# Altium project ESP32-C3-RF-V1.0.PrjPcb (part 3 of 4)
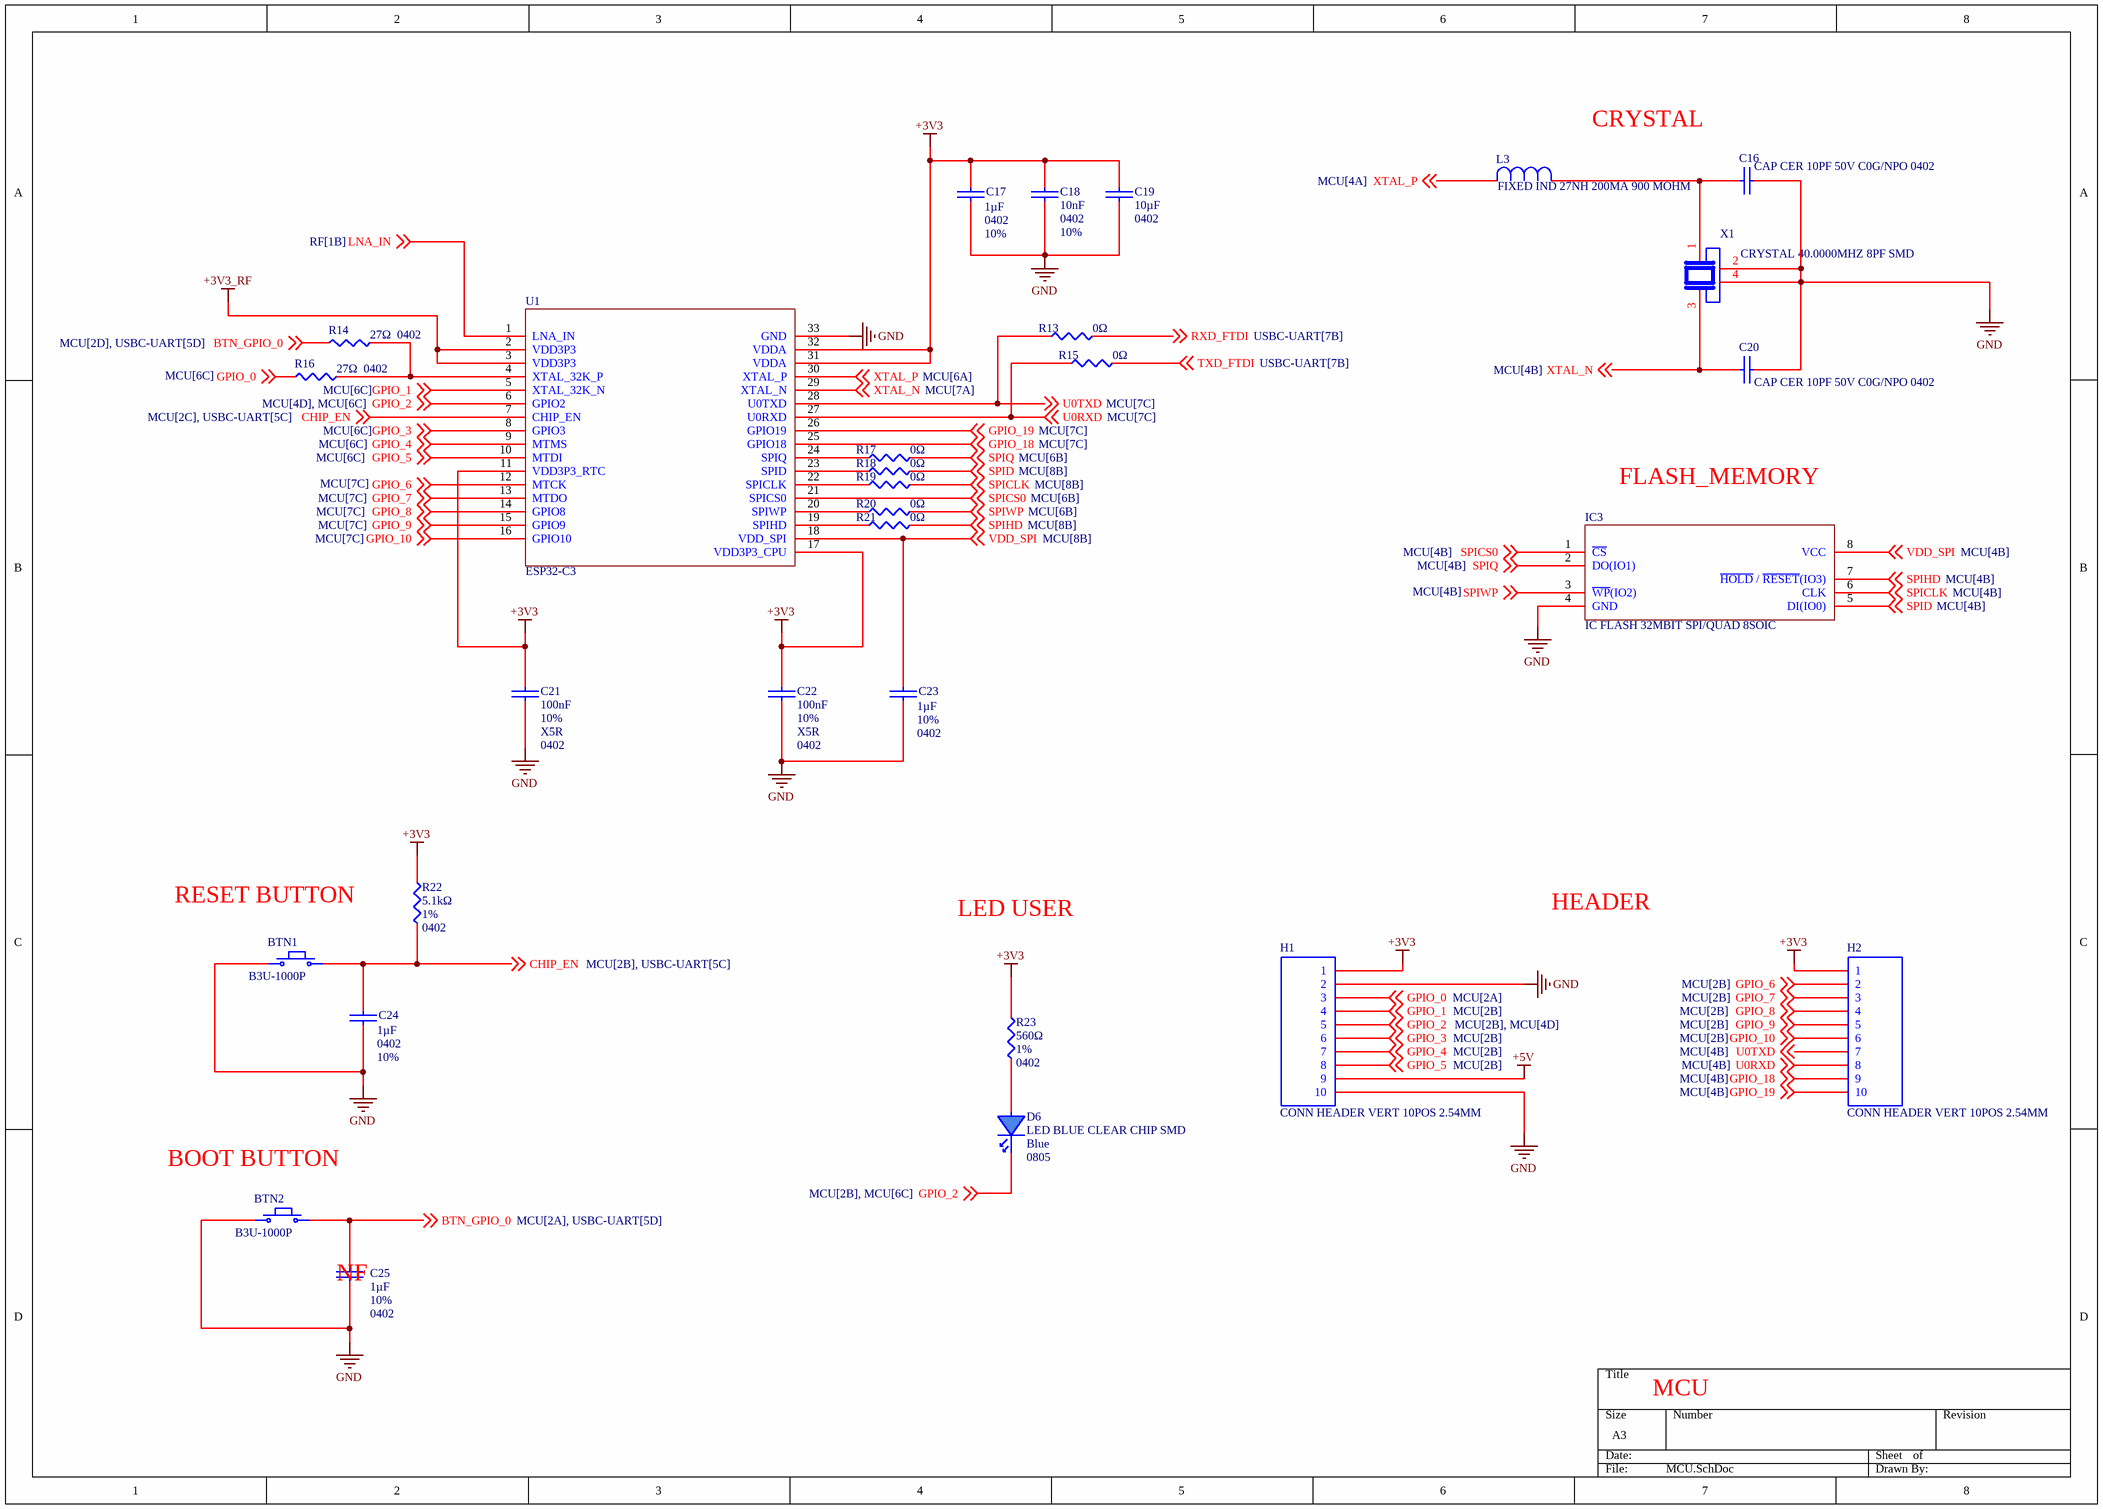
[diagram p6: MCU.SchDoc]

## Sheet MCU.SchDoc (continued)

### Parts
BTN1  SWITCH TACTILE SPST-NO 0.05A 12V  [SW_B3U-1000P]  (value not drawn)
BTN2  SWITCH TACTILE SPST-NO 0.05A 12V  [SW_B3U-1000P]  (value not drawn)
C16  CAP CER 10PF 50V C0G/NPO 0402  [C0402]
C17  value 1µF  Case/Package: 0402  Tolerance: 10%  [C0402]  (hidden comment: CAP CER 1UF 10V X5R 0402)
C18  value 10nF  Case/Package: 0402  Tolerance: 10%  [C0402]  (hidden comment: CAP CER 10000PF 16V X7R 0402)
C19  value 10µF  Case/Package: 0402  [C0402]  (hidden comment: CAP CER 10UF 10V X5R 0402)
C20  CAP CER 10PF 50V C0G/NPO 0402  [C0402]
C21  value 100nF  Tolerance: 10%  Dielectric: X5R  Case/Package: 0402  [C0402]  (hidden comment: CAP CER 100nF 50V X5R 0402)
C22  value 100nF  Tolerance: 10%  Dielectric: X5R  Case/Package: 0402  [C0402]  (hidden comment: CAP CER 100nF 50V X5R 0402)
C23  value 1µF  Case/Package: 0402  Tolerance: 10%  [C0402]  (hidden comment: CAP CER 1UF 10V X5R 0402)
C24  value 1µF  Case/Package: 0402  Tolerance: 10%  [C0402]  (hidden comment: CAP CER 1UF 10V X5R 0402)
C25  value 1µF  Case/Package: 0402  Tolerance: 10%  [C0402]  (hidden comment: CAP CER 1UF 10V X5R 0402)
D6  LED BLUE CLEAR CHIP SMD  Color: Blue  Case/Package: 0805  [LED_0805_BLUE]
H1  CONN HEADER VERT 10POS 2.54MM  [Header 1*10 2.54mm]
H2  CONN HEADER VERT 10POS 2.54MM  [Header 1*10 2.54mm]
IC3  IC FLASH 32MBIT SPI/QUAD 8SOIC  [SOIC-8_5P28X5P28_WIN-L]
L3  FIXED IND 27NH 200MA 900 MOHM  [IND_L-0402_JOT-L]
R13  value 0Ω  [R0402]  (hidden comment: RES 0 OHM JUMPER 1/16W 0402)
R14  value 27Ω  Case/Package: 0402  [R0402]  (hidden comment: RES SMD 27 OHM 1% 1/16W 0402)
R15  value 0Ω  [R0402]  (hidden comment: RES 0 OHM JUMPER 1/16W 0402)
R16  value 27Ω  Case/Package: 0402  [R0402]  (hidden comment: RES SMD 27 OHM 1% 1/16W 0402)
R17  value 0Ω  [R0402]  (hidden comment: RES 0 OHM JUMPER 1/16W 0402)
R18  value 0Ω  [R0402]  (hidden comment: RES 0 OHM JUMPER 1/16W 0402)
R19  value 0Ω  [R0402]  (hidden comment: RES 0 OHM JUMPER 1/16W 0402)
R20  value 0Ω  [R0402]  (hidden comment: RES 0 OHM JUMPER 1/16W 0402)
R21  value 0Ω  [R0402]  (hidden comment: RES 0 OHM JUMPER 1/16W 0402)
R22  value 5.1kΩ  Tolerance: 1%  Case/Package: 0402  [R0402]  (hidden comment: RES 5.1kΩ ±1% 62.5mW 0402)
R23  value 560Ω  Tolerance: 1%  Case/Package: 0402  [R0402]  (hidden comment: RES 560 OHM 1% 1/16W 0402)
U1  ESP32-C3  [ESP-C3]
X1  CRYSTAL 40.0000MHZ 8PF SMD  [OSC_XRCGB40M000F1S1BR0]

### Nets
+3V3: C17.1 C18.2 C19.2 C21.2 C22.2 H1.1 H2.1 R22.2 R23.2 U1.11(VDD3P3_RTC) U1.17(VDD3P3_CPU) U1.31(VDDA) U1.32(VDDA)
+3V3_RF: U1.2(VDD3P3) U1.3(VDD3P3)
+5V: H1.9
GND: BTN1.1 BTN2.1 C16.1 C17.2 C18.1 C19.1 C20.1 C21.1 C22.1 C23.1 C24.1 C25.1 H1.2 H1.10 IC3.4(GND) U1.33(GND) X1.2 X1.4
BTN_GPIO_0: BTN2.2 C25.2 R14.1 ; off-sheet BTN_GPIO_0
CHIP_EN: BTN1.2 C24.2 R22.1 U1.7(CHIP_EN) ; off-sheet CHIP_EN
GPIO_0: H1.3 R16.1 ; off-sheet GPIO_0
GPIO_1: H1.4 U1.5(XTAL_32K_N) ; off-sheet GPIO_1
GPIO_2: D6.1 H1.5 U1.6(GPIO2) ; off-sheet GPIO_2
GPIO_3: H1.6 U1.8(GPIO3) ; off-sheet GPIO_3
GPIO_4: H1.7 U1.9(MTMS) ; off-sheet GPIO_4
GPIO_5: H1.8 U1.10(MTDI) ; off-sheet GPIO_5
GPIO_6: H2.2 U1.12(MTCK) ; off-sheet GPIO_6
GPIO_7: H2.3 U1.13(MTDO) ; off-sheet GPIO_7
GPIO_8: H2.4 U1.14(GPIO8) ; off-sheet GPIO_8
GPIO_9: H2.5 U1.15(GPIO9) ; off-sheet GPIO_9
GPIO_10: H2.6 U1.16(GPIO10) ; off-sheet GPIO_10
GPIO_18: H2.9 U1.25(GPIO18) ; off-sheet GPIO_18
GPIO_19: H2.10 U1.26(GPIO19) ; off-sheet GPIO_19
LNA_IN: U1.1(LNA_IN) ; off-sheet LNA_IN
RXD_FTDI: R13.2 ; off-sheet RXD_FTDI
SPICLK: IC3.6(CLK) R19.2 ; off-sheet SPICLK
SPICS0: IC3.1(~{CS}) U1.21(SPICS0) ; off-sheet SPICS0
SPID: IC3.5(DI(IO0)) R18.2 ; off-sheet SPID
SPIHD: IC3.7(~{HOLD}_/_~{RESET}(IO3)) R21.2 ; off-sheet SPIHD
SPIQ: IC3.2(DO(IO1)) R17.2 ; off-sheet SPIQ
SPIWP: IC3.3(~{WP}(IO2)) R20.2 ; off-sheet SPIWP
TXD_FTDI: R15.2 ; off-sheet TXD_FTDI
U0RXD: H2.8 R15.1 U1.27(U0RXD) ; off-sheet U0RXD
U0TXD: H2.7 R13.1 U1.28(U0TXD) ; off-sheet U0TXD
VDD_SPI: C23.2 IC3.8(VCC) U1.18(VDD_SPI) ; off-sheet VDD_SPI
XTAL_N: C20.2 U1.29(XTAL_N) X1.3 ; off-sheet XTAL_N
XTAL_P: L3.2 U1.30(XTAL_P) ; off-sheet XTAL_P
NetC16_2: C16.2 L3.1 X1.1
NetD6_2: D6.2 R23.1
NetR14_2: R14.2 R16.2 U1.4(XTAL_32K_P)
NetR17_1: R17.1 U1.24(SPIQ)
NetR18_1: R18.1 U1.23(SPID)
NetR19_1: R19.1 U1.22(SPICLK)
NetR20_1: R20.1 U1.20(SPIWP)
NetR21_1: R21.1 U1.19(SPIHD)

### Notes on the sheet
- CRYSTAL
- FLASH_MEMORY
- RESET BUTTON
- LED USER
- HEADER
- (near BTN2) BOOT BUTTON
- (near C25) NF
- MCU
### Library data of the parts
BTN1 BTN2 = B3U-1000P: Switch Tactile N.O. SPST Round Button Solder Tab 12VDC 200000Cycles 1.5N SMD Emboss T/R; Manufacturer: Omron; Manufacturer Package Identifier: B3U-1000P(M); Actuator Length: 400µm; Contact Current Rating: 50mA; Contact Resistance: 100mΩ; Electrical Life: 200kcycles; Illumination Type: Illuminated, Non-Illuminated; Number of Positions: 1; Operating Force: 1.99N; Ratings: Dust Proof, IP40; Sealable: DUST PROOF; Switch Function: Off-Mom; Switch Travel: 150µm; Supplier: DigiKey; Supplier Part Number: SW1020CT-ND; Manufacturer Part Number: B3U-1000P; RoHS: Compliant; Category: Tactile Switches; Stock: 127276; Pricing: 1=1,17, 10=0,997, 25=0,9268, 100=0,8261, 250=0,76544, 500=0,72342, 1000=0,68504 (USD); Ambient Temperature Range High: 70°C; Color: Silver; Contact Material: Silver; Contact Plating: Silver; Current Rating: 50mA; Depth: 2.5mm; Height: 1.2mm; Insulation Resistance: 100MΩ; Lead Free: Lead Free; Length: 3mm; Life (Cycles): 200kcycles; Lifecycle Status: Production; Max Current Rating: 50mA; Max Operating Temperature: 70°C; Max Voltage Rating (DC): 12V; Mechanical Life: 200kcycles; Min Operating Temperature: -25°C; Mounting Technology: Surface Mount; Pins: 2; Packaging: Tape and Reel; REACH SVHC: Yes; Termination: SMD/SMT; Throw Configuration: SPST; Voltage Rating (DC): 12V; Weight: 21.99923mg; Width: 2.5mm; ComponentLink1URL: https://datasheet.octopart.com:443/B3U-1000P-Omron-datasheet-62106914.pdf?src-supplier=IHS; ComponentLink1Description: https://datasheet.octopart.com:443/B3U-1000P-Omron-datasheet-62106914.pdf?src-supplier=IHS; ComponentLink2URL: https://datasheet.octopart.com:443/B3U-1000P-Omron-datasheet-10910421.pdf?src-supplier=RS+(Formerly+Allied+Electronics); ComponentLink2Description: https://datasheet.octopart.com:443/B3U-1000P-Omron-datasheet-10910421.pdf?src-supplier=RS+(Formerly+Allied+Electronics); ComponentLink3URL: https://datasheet.octopart.com:443/B3U-1000P-Omron-datasheet-5458533.pdf?src-supplier=Upverter; ComponentLink3Description: https://datasheet.octopart.com:443/B3U-1000P-Omron-datasheet-5458533.pdf?src-supplier=Upverter; ComponentLink4URL: https://datasheet.octopart.com:443/B3U-1000P-Omron-datasheet-11968313.pdf?src-supplier=SOS+electronic; ComponentLink4Description: https://datasheet.octopart.com:443/B3U-1000P-Omron-datasheet-11968313.pdf?src-supplier=SOS+electronic; ComponentLink5URL: https://datasheet.octopart.com:443/B3U-1000P-Omron-datasheet-110759174.pdf?src-supplier=Newark; ComponentLink5Description: https://datasheet.octopart.com:443/B3U-1000P-Omron-datasheet-110759174.pdf?src-supplier=Newark; ComponentLink6URL: https://datasheet.octopart.com:443/B3U-1000P-Omron-datasheet-506776.pdf?src-supplier=Newark; ComponentLink6Description: https://datasheet.octopart.com:443/B3U-1000P-Omron-datasheet-506776.pdf?src-supplier=Newark; ComponentLink7URL: https://datasheet.octopart.com:443/B3U-1000P-Omron-datasheet-17589256.pdf?src-supplier=TME; ComponentLink7Description: https://datasheet.octopart.com:443/B3U-1000P-Omron-datasheet-17589256.pdf?src-supplier=TME; LCSC Part: C231329
C16 C20 = CC0402FPNPO9BN100: Ceramic Capacitor, Multilayer, Ceramic, 50V, 1% +Tol, 1% -Tol, C0G, 30ppm/Cel TC, 0.00001uF, Surface Mount, 0402; Manufacturer: Yageo Group; Supplier: DigiKey; Supplier Part Number: 13-CC0402FPNPO9BN100CT-ND; Manufacturer Part Number: CC0402FPNPO9BN100; RoHS: Compliant; Category: Ceramic Capacitors; Stock: 180901; Pricing: 1=0,1, 10=0,05, 50=0,034, 100=0,0292, 500=0,02122, 1000=0,01878, 2500=0,01622, 5000=0,01467 (USD); China RoHS: Compliant; Country of Origin: Mainland China, Taiwan; Dielectric Material: Ceramic; Export Control Classification Number (ECCN) Code: EAR99; Height: 500µm; Harmonized Tariff Schedule (HTS) Code: 8532.24.00.20; Introduction Date: 2009-04-16; Length: 1mm; Lifecycle Status: Production; Max Operating Temperature: 125°C; Min Operating Temperature: -55°C; Mounting Technology: Surface Mount; Number of Terminals: 2; REACH SVHC: Yes; Voltage Rating (DC): 50V; Width: 500µm; ComponentLink1URL: https://datasheet.octopart.com:443/CC0402FPNPO9BN100-Yageo-datasheet-182140217.pdf?src-supplier=IHS; ComponentLink1Description: https://datasheet.octopart.com:443/CC0402FPNPO9BN100-Yageo-datasheet-182140217.pdf?src-supplier=IHS; ComponentLink2URL: http://sigma.octopart.com:80/conflict_mineral_statement/Yageo-company-3.pdf?src-supplier=Compliance+Statements; ComponentLink2Description: http://sigma.octopart.com:80/conflict_mineral_statement/Yageo-company-3.pdf?src-supplier=Compliance+Statements; ComponentLink3URL: http://sigma.octopart.com:80/rohs_statement/Yageo-company-2.pdf?src-supplier=Compliance+Statements; ComponentLink3Description: http://sigma.octopart.com:80/rohs_statement/Yageo-company-2.pdf?src-supplier=Compliance+Statements; LCSC Part: C3896396; Value: 10pF
C17 C23-C25 = CC0402KRX5R6BB105: Multilayer Ceramic Capacitors MLCC – SMD/SMT; YAGEO; CC0402KRX5R6BB105; 1 µF; 0402; 10 V; 10 V; Manufacturer: Yageo Group; Dissipation Factor: 15%; Temperature Coefficient: 30ppm/°C; Supplier: DigiKey; Supplier Part Number: 311-1439-1-ND; Manufacturer Part Number: CC0402KRX5R6BB105; RoHS: Compliant; Category: Ceramic Capacitors; Stock: 575623; Pricing: 1=0,11, 10=0,06, 50=0,0412, 100=0,0356, 500=0,02612, 1000=0,02323, 2500=0,02018, 5000=0,01835 (USD); Case Code (Imperial): 0402; Case Code (Metric): 1005; China RoHS: Compliant; Composition: Ceramic; Country of Origin: Mainland China, Taiwan; Depth: 500µm; Dielectric: X5R; Dielectric Material: Ceramic; Export Control Classification Number (ECCN) Code: EAR99; Halogen Free: Halogen Free; Height: 500µm; Harmonized Tariff Schedule (HTS) Code: 8532.24.00.20; Introduction Date: 2009-04-16; Lead Free: Lead Free; Length: 1mm; Lifecycle Status: Production; Material: Ceramic; Max Operating Temperature: 85°C; Min Operating Temperature: -55°C; Mounting Technology: Surface Mount; Pins: 2; Number of Terminals: 2; Packaging: Cut Tape (CT); Radiation Hardening: No; REACH SVHC: Yes; Schedule B: 8532240020, 8532240020|8532240020|8532240020|8532240020|8532240020|8532240020|8532240020|8532240020|8532240020|8532240020|8532240020|8532240020|8532240020|8532240020|8532240020|8532240020|8532240020|8532240020|8532240020|8532240020|8532240020|8532240020|8532240020|85; Termination: SMD/SMT; Thickness: 558.8µm; Voltage Rating: 10V; Voltage Rating (DC): 10V; Width: 500µm; ComponentLink1URL: https://datasheet.octopart.com:443/CC0402KRX5R6BB105-Yageo-datasheet-170350636.pdf?src-supplier=IHS; ComponentLink1Description: https://datasheet.octopart.com:443/CC0402KRX5R6BB105-Yageo-datasheet-170350636.pdf?src-supplier=IHS; ComponentLink2URL: https://datasheet.octopart.com:443/CC0402KRX5R6BB105-Yageo-datasheet-10911834.pdf?src-supplier=Farnell; ComponentLink2Description: https://datasheet.octopart.com:443/CC0402KRX5R6BB105-Yageo-datasheet-10911834.pdf?src-supplier=Farnell; ComponentLink3URL: https://datasheet.octopart.com:443/CC0402KRX5R6BB105-Yageo-datasheet-78855684.pdf?src-supplier=Upverter; ComponentLink3Description: https://datasheet.octopart.com:443/CC0402KRX5R6BB105-Yageo-datasheet-78855684.pdf?src-supplier=Upverter; ComponentLink4URL: https://datasheet.octopart.com:443/CC0402KRX5R6BB105-Yageo-datasheet-8324442.pdf?src-supplier=element14+APAC; ComponentLink4Description: https://datasheet.octopart.com:443/CC0402KRX5R6BB105-Yageo-datasheet-8324442.pdf?src-supplier=element14+APAC; ComponentLink5URL: https://datasheet.octopart.com:443/CC0402KRX5R6BB105-Yageo-datasheet-181967186.pdf?src-supplier=Newark; ComponentLink5Description: https://datasheet.octopart.com:443/CC0402KRX5R6BB105-Yageo-datasheet-181967186.pdf?src-supplier=Newark; ComponentLink6URL: https://datasheet.octopart.com:443/CC0402KRX5R6BB105-Yageo-datasheet-181967185.pdf?src-supplier=Newark; ComponentLink6Description: https://datasheet.octopart.com:443/CC0402KRX5R6BB105-Yageo-datasheet-181967185.pdf?src-supplier=Newark; ComponentLink7URL: https://datasheet.octopart.com:443/CC0402KRX5R6BB105-Yageo-datasheet-519481.pdf?src-supplier=Newark; ComponentLink7Description: https://datasheet.octopart.com:443/CC0402KRX5R6BB105-Yageo-datasheet-519481.pdf?src-supplier=Newark; ComponentLink8URL: https://datasheet.octopart.com:443/CC0402KRX5R6BB105-Yageo-datasheet-62067349.pdf?src-supplier=Newark; ComponentLink8Description: https://datasheet.octopart.com:443/CC0402KRX5R6BB105-Yageo-datasheet-62067349.pdf?src-supplier=Newark; ComponentLink9URL: https://datasheet.octopart.com:443/CC0402KRX5R6BB105-Yageo-datasheet-169689537.pdf?src-supplier=Newark; ComponentLink9Description: https://datasheet.octopart.com:443/CC0402KRX5R6BB105-Yageo-datasheet-169689537.pdf?src-supplier=Newark; ComponentLink10URL: https://datasheet.octopart.com:443/CC0402KRX5R6BB105-Yageo-datasheet-158238148.pdf?src-supplier=JRH+Electronics; ComponentLink10Description: https://datasheet.octopart.com:443/CC0402KRX5R6BB105-Yageo-datasheet-158238148.pdf?src-supplier=JRH+Electronics; ComponentLink11URL: https://datasheet.octopart.com/CC0402KRX5R6BB105-Yageo-datasheet-86397281.pdf; ComponentLink11Description: https://datasheet.octopart.com/CC0402KRX5R6BB105-Yageo-datasheet-86397281.pdf; ComponentLink12URL: https://datasheet.octopart.com:443/CC0402KRX5R6BB105-Yageo-datasheet-149070021.pdf?src-supplier=TME; ComponentLink12Description: https://datasheet.octopart.com:443/CC0402KRX5R6BB105-Yageo-datasheet-149070021.pdf?src-supplier=TME; ComponentLink13URL: https://datasheet.octopart.com:443/CC0402KRX5R6BB105-Yageo-Group-datasheet-145016144.pdf?src-supplier=ODG+(Origin+Data+Global); ComponentLink13Description: https://datasheet.octopart.com:443/CC0402KRX5R6BB105-Yageo-Group-datasheet-145016144.pdf?src-supplier=ODG+(Origin+Data+Global); ComponentLink14URL: https://datasheet.octopart.com:443/CC0402KRX5R6BB105-Yageo-datasheet-137875056.pdf?src-supplier=Future+Electronics; ComponentLink14Description: https://datasheet.octopart.com:443/CC0402KRX5R6BB105-Yageo-datasheet-137875056.pdf?src-supplier=Future+Electronics; ComponentLink15URL: https://datasheet.octopart.com:443/CC0402KRX5R6BB105-Yageo-datasheet-137700085.pdf?src-supplier=Future+Electronics; ComponentLink15Description: https://datasheet.octopart.com:443/CC0402KRX5R6BB105-Yageo-datasheet-137700085.pdf?src-supplier=Future+Electronics; ComponentLink16URL: https://datasheet.octopart.com:443/CC0402KRX5R6BB105-Yageo-datasheet-59875459.pdf?src-supplier=Future+Electronics; ComponentLink16Description: https://datasheet.octopart.com:443/CC0402KRX5R6BB105-Yageo-datasheet-59875459.pdf?src-supplier=Future+Electronics; ComponentLink17URL: https://datasheet.octopart.com:443/CC0402KRX5R6BB105-Yageo-datasheet-24578986.pdf?src-supplier=Future+Electronics; ComponentLink17Description: https://datasheet.octopart.com:443/CC0402KRX5R6BB105-Yageo-datasheet-24578986.pdf?src-supplier=Future+Electronics; ComponentLink18URL: https://datasheet.octopart.com:443/CC0402KRX5R6BB105-Yageo-datasheet-8701639.pdf?src-supplier=element14; ComponentLink18Description: https://datasheet.octopart.com:443/CC0402KRX5R6BB105-Yageo-datasheet-8701639.pdf?src-supplier=element14; ComponentLink19URL: https://datasheet.octopart.com:443/CC0402KRX5R6BB105-Yageo-datasheet-68071816.pdf?src-supplier=Megastar; ComponentLink19Description: https://datasheet.octopart.com:443/CC0402KRX5R6BB105-Yageo-datasheet-68071816.pdf?src-supplier=Megastar; ComponentLink20URL: http://sigma.octopart.com:80/conflict_mineral_statement/Yageo-company-3.pdf?src-supplier=Compliance+Statements; ComponentLink20Description: http://sigma.octopart.com:80/conflict_mineral_statement/Yageo-company-3.pdf?src-supplier=Compliance+Statements; ComponentLink21URL: http://sigma.octopart.com:80/rohs_statement/Yageo-company-2.pdf?src-supplier=Compliance+Statements; ComponentLink21Description: http://sigma.octopart.com:80/rohs_statement/Yageo-company-2.pdf?src-supplier=Compliance+Statements; LCSC Part: C106254
C18 = CC0402KRX7R7BB103: Multilayer Ceramic Capacitors MLCC - SMD/SMT 16V 0.01uF X7R 0402 10%; Manufacturer: Yageo Group; Dissipation Factor: 3.5%; Temperature Coefficient: 30ppm/°C; Supplier: DigiKey; Supplier Part Number: 311-1042-1-ND; Manufacturer Part Number: CC0402KRX7R7BB103; RoHS: Compliant; Category: Ceramic Capacitors; Stock: 5468572; Pricing: 1=0,1, 10=0,019, 50=0,0124, 100=0,0105, 500=0,00728, 1000=0,0063, 2500=0,00527, 5000=0,00465 (USD); Case Code (Imperial): 0402; Case Code (Metric): 1005; China RoHS: Compliant; Country of Origin: Mainland China, Taiwan; Depth: 500µm; Dielectric: X7R; Dielectric Material: Ceramic; Export Control Classification Number (ECCN) Code: EAR99; Halogen Free: Halogen Free; Height: 500µm; Harmonized Tariff Schedule (HTS) Code: 8532.24.00.20; Introduction Date: 2003-01-27; Lead Free: Lead Free; Length: 1mm; Lifecycle Status: Production; Material: Ceramic; Max Operating Temperature: 125°C; Min Operating Temperature: -55°C; Mounting Technology: Surface Mount; Pins: 2; Number of Terminals: 2; Radiation Hardening: No; REACH SVHC: Yes; Schedule B: 8532240020, 8532240020|8532240020, 8532240020|8532240020|8532240020, 8532240020|8532240020|8532240020|8532240020; Termination: SMD/SMT; Thickness: 558.8µm; Voltage: 16V; Voltage Rating: 16V; Voltage Rating (AC): 16V; Voltage Rating (DC): 16V; Width: 500µm; ComponentLink1URL: https://datasheet.octopart.com:443/CC0402KRX7R7BB103-Yageo-datasheet-177165144.pdf?src-supplier=IHS; ComponentLink1Description: https://datasheet.octopart.com:443/CC0402KRX7R7BB103-Yageo-datasheet-177165144.pdf?src-supplier=IHS; ComponentLink2URL: https://datasheet.octopart.com:443/CC0402KRX7R7BB103-Yageo-datasheet-78855684.pdf?src-supplier=Upverter; ComponentLink2Description: https://datasheet.octopart.com:443/CC0402KRX7R7BB103-Yageo-datasheet-78855684.pdf?src-supplier=Upverter; ComponentLink3URL: https://datasheet.octopart.com/CC0402KRX7R7BB103-Yageo-datasheet-10883670.pdf; ComponentLink3Description: https://datasheet.octopart.com/CC0402KRX7R7BB103-Yageo-datasheet-10883670.pdf; ComponentLink4URL: https://datasheet.octopart.com:443/CC0402KRX7R7BB103-Yageo-datasheet-147453679.pdf?src-supplier=Newark; ComponentLink4Description: https://datasheet.octopart.com:443/CC0402KRX7R7BB103-Yageo-datasheet-147453679.pdf?src-supplier=Newark; ComponentLink5URL: https://datasheet.octopart.com:443/CC0402KRX7R7BB103-Phycomp-datasheet-499490.pdf?src-supplier=Newark; ComponentLink5Description: https://datasheet.octopart.com:443/CC0402KRX7R7BB103-Phycomp-datasheet-499490.pdf?src-supplier=Newark; ComponentLink6URL: https://datasheet.octopart.com:443/CC0402KRX7R7BB103-Yageo-datasheet-15895757.pdf?src-supplier=Newark; ComponentLink6Description: https://datasheet.octopart.com:443/CC0402KRX7R7BB103-Yageo-datasheet-15895757.pdf?src-supplier=Newark; ComponentLink7URL: https://datasheet.octopart.com:443/CC0402KRX7R7BB103-Yageo-datasheet-182050773.pdf?src-supplier=Newark; ComponentLink7Description: https://datasheet.octopart.com:443/CC0402KRX7R7BB103-Yageo-datasheet-182050773.pdf?src-supplier=Newark; ComponentLink8URL: https://datasheet.octopart.com:443/CC0402KRX7R7BB103-Yageo-datasheet-182050772.pdf?src-supplier=Newark; ComponentLink8Description: https://datasheet.octopart.com:443/CC0402KRX7R7BB103-Yageo-datasheet-182050772.pdf?src-supplier=Newark; ComponentLink9URL: https://datasheet.octopart.com:443/CC0402KRX7R7BB103-Yageo-datasheet-62336348.pdf?src-supplier=Farnell; ComponentLink9Description: https://datasheet.octopart.com:443/CC0402KRX7R7BB103-Yageo-datasheet-62336348.pdf?src-supplier=Farnell; ComponentLink10URL: https://datasheet.octopart.com:443/CC0402KRX7R7BB103-Yageo-datasheet-151948686.pdf?src-supplier=Farnell; ComponentLink10Description: https://datasheet.octopart.com:443/CC0402KRX7R7BB103-Yageo-datasheet-151948686.pdf?src-supplier=Farnell; ComponentLink11URL: https://datasheet.octopart.com:443/CC0402KRX7R7BB103-Phycomp-datasheet-500777.pdf?src-supplier=Farnell; ComponentLink11Description: https://datasheet.octopart.com:443/CC0402KRX7R7BB103-Phycomp-datasheet-500777.pdf?src-supplier=Farnell; ComponentLink12URL: https://datasheet.octopart.com:443/CC0402KRX7R7BB103-Phycomp-datasheet-5301394.pdf?src-supplier=element14; ComponentLink12Description: https://datasheet.octopart.com:443/CC0402KRX7R7BB103-Phycomp-datasheet-5301394.pdf?src-supplier=element14; ComponentLink13URL: https://datasheet.octopart.com:443/CC0402KRX7R7BB103-Yageo-datasheet-8701427.pdf?src-supplier=element14; ComponentLink13Description: https://datasheet.octopart.com:443/CC0402KRX7R7BB103-Yageo-datasheet-8701427.pdf?src-supplier=element14; ComponentLink14URL: https://datasheet.octopart.com:443/CC0402KRX7R7BB103-Yageo-datasheet-166511530.pdf?src-supplier=Future+Electronics; ComponentLink14Description: https://datasheet.octopart.com:443/CC0402KRX7R7BB103-Yageo-datasheet-166511530.pdf?src-supplier=Future+Electronics; ComponentLink15URL: https://datasheet.octopart.com:443/CC0402KRX7R7BB103-Yageo-datasheet-137700085.pdf?src-supplier=Future+Electronics; ComponentLink15Description: https://datasheet.octopart.com:443/CC0402KRX7R7BB103-Yageo-datasheet-137700085.pdf?src-supplier=Future+Electronics; ComponentLink16URL: https://datasheet.octopart.com:443/CC0402KRX7R7BB103-Yageo-datasheet-137700084.pdf?src-supplier=Future+Electronics; ComponentLink16Description: https://datasheet.octopart.com:443/CC0402KRX7R7BB103-Yageo-datasheet-137700084.pdf?src-supplier=Future+Electronics; ComponentLink17URL: https://datasheet.octopart.com:443/CC0402KRX7R7BB103-Yageo-datasheet-27626582.pdf?src-supplier=Future+Electronics; ComponentLink17Description: https://datasheet.octopart.com:443/CC0402KRX7R7BB103-Yageo-datasheet-27626582.pdf?src-supplier=Future+Electronics; ComponentLink18URL: https://datasheet.octopart.com:443/CC0402KRX7R7BB103-Yageo-datasheet-24578986.pdf?src-supplier=Future+Electronics; ComponentLink18Description: https://datasheet.octopart.com:443/CC0402KRX7R7BB103-Yageo-datasheet-24578986.pdf?src-supplier=Future+Electronics; ComponentLink19URL: https://datasheet.octopart.com:443/CC0402KRX7R7BB103-Yageo-datasheet-12526321.pdf?src-supplier=Future+Electronics; ComponentLink19Description: https://datasheet.octopart.com:443/CC0402KRX7R7BB103-Yageo-datasheet-12526321.pdf?src-supplier=Future+Electronics; ComponentLink20URL: https://datasheet.octopart.com:443/CC0402KRX7R7BB103-Yageo-datasheet-10911834.pdf?src-supplier=Future+Electronics; ComponentLink20Description: https://datasheet.octopart.com:443/CC0402KRX7R7BB103-Yageo-datasheet-10911834.pdf?src-supplier=Future+Electronics; ComponentLink21URL: https://datasheet.octopart.com:443/CC0402KRX7R7BB103-Yageo-datasheet-8324442.pdf?src-supplier=Future+Electronics; ComponentLink21Description: https://datasheet.octopart.com:443/CC0402KRX7R7BB103-Yageo-datasheet-8324442.pdf?src-supplier=Future+Electronics; ComponentLink22URL: https://datasheet.octopart.com:443/CC0402KRX7R7BB103-Yageo-Group-datasheet-165992755.pdf?src-supplier=ODG+(Origin+Data+Global); ComponentLink22Description: https://datasheet.octopart.com:443/CC0402KRX7R7BB103-Yageo-Group-datasheet-165992755.pdf?src-supplier=ODG+(Origin+Data+Global); ComponentLink23URL: https://datasheet.octopart.com:443/CC0402KRX7R7BB103-Yageo-datasheet-118396.pdf?src-supplier=DigiKey; ComponentLink23Description: https://datasheet.octopart.com:443/CC0402KRX7R7BB103-Yageo-datasheet-118396.pdf?src-supplier=DigiKey; ComponentLink24URL: http://sigma.octopart.com:80/conflict_mineral_statement/Yageo-company-3.pdf?src-supplier=Compliance+Statements; ComponentLink24Description: http://sigma.octopart.com:80/conflict_mineral_statement/Yageo-company-3.pdf?src-supplier=Compliance+Statements; ComponentLink25URL: http://sigma.octopart.com:80/rohs_statement/Yageo-company-2.pdf?src-supplier=Compliance+Statements; ComponentLink25Description: http://sigma.octopart.com:80/rohs_statement/Yageo-company-2.pdf?src-supplier=Compliance+Statements; LCSC Part: C327009
C19 = GRM155R61A106ME11D: 10V 10uF X5R ±20% 0402 Multilayer Ceramic Capacitors MLCC - SMD/SMT ROHS; Manufacturer: Murata; Manufacturer Lifecycle Status: IN PRODUCTION; Supplier: DigiKey; Supplier Part Number: 490-GRM155R61A106ME11DCT-ND; Manufacturer Part Number: GRM155R61A106ME11D; RoHS: Compliant; Category: Ceramic Capacitors; Stock: 2420356; Pricing: 1=0,11, 10=0,063, 50=0,0436, 100=0,0376, 500=0,02772, 1000=0,02467, 2500=0,02148, 5000=0,01955 (USD); Country of Origin: Philippines; Dielectric: X5R; Dielectric Material: Ceramic; Export Control Classification Number (ECCN) Code: EAR99; Height: 500µm; Harmonized Tariff Schedule (HTS) Code: 8532.24.00.20; Introduction Date: 2018-10-26; Length: 1mm; Lifecycle Status: Production; Material: Ceramic; Max Operating Temperature: 85°C; Min Operating Temperature: -55°C; Mounting Technology: Surface Mount; Number of Terminals: 2; REACH SVHC: Yes; Thickness: 500µm; Tolerance: 20%; Voltage Rating: 10V; Voltage Rating (DC): 10V; Width: 500µm; ComponentLink1URL: https://datasheet.octopart.com:443/GRM155R61A106ME11D-Murata-datasheet-155239053.pdf?src-supplier=Newark; ComponentLink1Description: https://datasheet.octopart.com:443/GRM155R61A106ME11D-Murata-datasheet-155239053.pdf?src-supplier=Newark; ComponentLink2URL: https://datasheet.octopart.com:443/GRM155R61A106ME11D-Murata-datasheet-178522865.pdf?src-supplier=Arrow.cn; ComponentLink2Description: https://datasheet.octopart.com:443/GRM155R61A106ME11D-Murata-datasheet-178522865.pdf?src-supplier=Arrow.cn; ComponentLink3URL: https://datasheet.octopart.com:443/GRM155R61A106ME11D-Murata-datasheet-165579666.pdf?src-supplier=TME; ComponentLink3Description: https://datasheet.octopart.com:443/GRM155R61A106ME11D-Murata-datasheet-165579666.pdf?src-supplier=TME; ComponentLink4URL: https://datasheet.octopart.com:443/GRM155R61A106ME11D-Murata-datasheet-141266224.pdf?src-supplier=Ciiva; ComponentLink4Description: https://datasheet.octopart.com:443/GRM155R61A106ME11D-Murata-datasheet-141266224.pdf?src-supplier=Ciiva; ComponentLink5URL: https://datasheet.octopart.com:443/GRM155R61A106ME11D-Murata-datasheet-140689744.pdf?src-supplier=Ciiva; ComponentLink5Description: https://datasheet.octopart.com:443/GRM155R61A106ME11D-Murata-datasheet-140689744.pdf?src-supplier=Ciiva; ComponentLink6URL: https://datasheet.octopart.com:443/GRM155R61A106ME11D-Murata-datasheet-138740692.pdf?src-supplier=Ciiva; ComponentLink6Description: https://datasheet.octopart.com:443/GRM155R61A106ME11D-Murata-datasheet-138740692.pdf?src-supplier=Ciiva; ComponentLink7URL: https://datasheet.octopart.com/GRM155R61A106ME11D-Murata-datasheet-12515295.pdf; ComponentLink7Description: https://datasheet.octopart.com/GRM155R61A106ME11D-Murata-datasheet-12515295.pdf; ComponentLink8URL: https://datasheet.octopart.com/GRM155R61A106ME11D-Murata-datasheet-12510076.pdf; ComponentLink8Description: https://datasheet.octopart.com/GRM155R61A106ME11D-Murata-datasheet-12510076.pdf; ComponentLink9URL: https://datasheet.octopart.com/GRM155R61A106ME11D-Murata-datasheet-11978611.pdf; ComponentLink9Description: https://datasheet.octopart.com/GRM155R61A106ME11D-Murata-datasheet-11978611.pdf; ComponentLink10URL: https://datasheet.octopart.com/GRM155R61A106ME11D-Murata-datasheet-10025737.pdf; ComponentLink10Description: https://datasheet.octopart.com/GRM155R61A106ME11D-Murata-datasheet-10025737.pdf; ComponentLink11URL: https://datasheet.octopart.com/GRM155R61A106ME11D-Murata-datasheet-8819587.pdf; ComponentLink11Description: https://datasheet.octopart.com/GRM155R61A106ME11D-Murata-datasheet-8819587.pdf; ComponentLink12URL: http://sigma.octopart.com:80/reach_statement/Murata-company-16.pdf?src-supplier=Compliance+Statements; ComponentLink12Description: http://sigma.octopart.com:80/reach_statement/Murata-company-16.pdf?src-supplier=Compliance+Statements; LCSC Part: C408132
C21 C22 = CC0402KRX5R9BB104: 50V 100nF X5R ±10% 0402 Multilayer Ceramic Capacitors MLCC - SMD/SMT ROHS; Manufacturer: Yageo Group; Temperature Coefficient: 30ppm/°C; Supplier: DigiKey; Supplier Part Number: 311-3342-2-ND; Manufacturer Part Number: CC0402KRX5R9BB104; RoHS: Compliant; Category: Ceramic Capacitors; Stock: 2840000; Pricing: 10000=0,00742, 20000=0,00677, 30000=0,00644, 50000=0,00608, 70000=0,00587, 100000=0,00567 (USD); China RoHS: Compliant; Country of Origin: Mainland China, Taiwan; Dielectric Material: Ceramic; Export Control Classification Number (ECCN) Code: EAR99; Halogen Free: Halogen Free; Height: 500µm; Harmonized Tariff Schedule (HTS) Code: 8532.24.00.20; Introduction Date: 2013-02-05; Lead Free: Lead Free; Length: 1mm; Lifecycle Status: Production; Material: Ceramic; Max Operating Temperature: 85°C; Min Operating Temperature: -55°C; Mounting Technology: Surface Mount; Number of Terminals: 2; REACH SVHC: Yes; Schedule B: 8532240020, 8532240020|8532240020|8532240020|8532240020|8532240020|8532240020|8532240020|8532240020|8532240020|8532240020|8532240020|8532240020|8532240020|8532240020|8532240020|8532240020|8532240020|8532240020|8532240020|8532240020|8532240020|8532240020|8532240020|85; Thickness: 558.8µm; Voltage Rating: 50V; Voltage Rating (DC): 50V; Width: 500µm; ComponentLink1URL: https://datasheet.octopart.com:443/CC0402KRX5R9BB104-Yageo-datasheet-170350636.pdf?src-supplier=IHS; ComponentLink1Description: https://datasheet.octopart.com:443/CC0402KRX5R9BB104-Yageo-datasheet-170350636.pdf?src-supplier=IHS; ComponentLink2URL: https://datasheet.octopart.com:443/CC0402KRX5R9BB104-Yageo-datasheet-78855684.pdf?src-supplier=Upverter; ComponentLink2Description: https://datasheet.octopart.com:443/CC0402KRX5R9BB104-Yageo-datasheet-78855684.pdf?src-supplier=Upverter; ComponentLink3URL: https://datasheet.octopart.com:443/CC0402KRX5R9BB104-Yageo-datasheet-140260304.pdf?src-supplier=Newark; ComponentLink3Description: https://datasheet.octopart.com:443/CC0402KRX5R9BB104-Yageo-datasheet-140260304.pdf?src-supplier=Newark; ComponentLink4URL: https://datasheet.octopart.com:443/CC0402KRX5R9BB104-Yageo-datasheet-158238148.pdf?src-supplier=Newark; ComponentLink4Description: https://datasheet.octopart.com:443/CC0402KRX5R9BB104-Yageo-datasheet-158238148.pdf?src-supplier=Newark; ComponentLink5URL: https://datasheet.octopart.com:443/CC0402KRX5R9BB104-Yageo-datasheet-182029422.pdf?src-supplier=Farnell; ComponentLink5Description: https://datasheet.octopart.com:443/CC0402KRX5R9BB104-Yageo-datasheet-182029422.pdf?src-supplier=Farnell; ComponentLink6URL: https://datasheet.octopart.com/CC0402KRX5R9BB104-Yageo-datasheet-86397281.pdf; ComponentLink6Description: https://datasheet.octopart.com/CC0402KRX5R9BB104-Yageo-datasheet-86397281.pdf; ComponentLink7URL: https://datasheet.octopart.com:443/CC0402KRX5R9BB104-Yageo-datasheet-149070021.pdf?src-supplier=TME; ComponentLink7Description: https://datasheet.octopart.com:443/CC0402KRX5R9BB104-Yageo-datasheet-149070021.pdf?src-supplier=TME; ComponentLink8URL: https://datasheet.octopart.com:443/CC0402KRX5R9BB104-Yageo-Group-datasheet-145016144.pdf?src-supplier=ODG+(Origin+Data+Global); ComponentLink8Description: https://datasheet.octopart.com:443/CC0402KRX5R9BB104-Yageo-Group-datasheet-145016144.pdf?src-supplier=ODG+(Origin+Data+Global); ComponentLink9URL: https://datasheet.octopart.com:443/CC0402KRX5R9BB104-Yageo-datasheet-137875056.pdf?src-supplier=Future+Electronics; ComponentLink9Description: https://datasheet.octopart.com:443/CC0402KRX5R9BB104-Yageo-datasheet-137875056.pdf?src-supplier=Future+Electronics; ComponentLink10URL: https://datasheet.octopart.com:443/CC0402KRX5R9BB104-Yageo-datasheet-137700085.pdf?src-supplier=Future+Electronics; ComponentLink10Description: https://datasheet.octopart.com:443/CC0402KRX5R9BB104-Yageo-datasheet-137700085.pdf?src-supplier=Future+Electronics; ComponentLink11URL: https://datasheet.octopart.com:443/CC0402KRX5R9BB104-Yageo-datasheet-62067349.pdf?src-supplier=Future+Electronics; ComponentLink11Description: https://datasheet.octopart.com:443/CC0402KRX5R9BB104-Yageo-datasheet-62067349.pdf?src-supplier=Future+Electronics; ComponentLink12URL: https://datasheet.octopart.com:443/CC0402KRX5R9BB104-Yageo-datasheet-68071816.pdf?src-supplier=Future+Electronics; ComponentLink12Description: https://datasheet.octopart.com:443/CC0402KRX5R9BB104-Yageo-datasheet-68071816.pdf?src-supplier=Future+Electronics; ComponentLink13URL: https://datasheet.octopart.com:443/CC0402KRX5R9BB104-Yageo-datasheet-68297942.pdf?src-supplier=Future+Electronics; ComponentLink13Description: https://datasheet.octopart.com:443/CC0402KRX5R9BB104-Yageo-datasheet-68297942.pdf?src-supplier=Future+Electronics; ComponentLink14URL: http://sigma.octopart.com:80/conflict_mineral_statement/Yageo-company-3.pdf?src-supplier=Compliance+Statements; ComponentLink14Description: http://sigma.octopart.com:80/conflict_mineral_statement/Yageo-company-3.pdf?src-supplier=Compliance+Statements; ComponentLink15URL: http://sigma.octopart.com:80/rohs_statement/Yageo-company-2.pdf?src-supplier=Compliance+Statements; ComponentLink15Description: http://sigma.octopart.com:80/rohs_statement/Yageo-company-2.pdf?src-supplier=Compliance+Statements; LCSC Part: C105882
D6 = LTST-C171TBKT: LED blue LED0805 wavelength 465~475nm light intensity 28~180mcd vertical sticker; Manufacturer: Diodes Inc.; Dominant Wavelength: 475nm; Forward Current: 20mA; Forward Voltage: 3.8V; Lens Color: Clear, Colorless; Luminous Intensity: 30mcd; Number of Circuits: 1; Peak Wavelength: 468nm; Power Dissipation: 76mW; Reverse Voltage: 5V; Shape: Rectangular; Viewing Angle: 130°; Supplier: DigiKey; Supplier Part Number: 160-1645-1-ND; Manufacturer Part Number: LTST-C171TBKT; RoHS: Compliant; Category: LEDs; Stock: 36169; Pricing: 1=0,21, 10=0,145, 100=0,1008, 500=0,08064, 1000=0,07393 (USD); Case Code (Imperial): 0805; Case Code (Metric): 2012; China RoHS: Compliant; Depth: 1.25mm; Export Control Classification Number (ECCN) Code: EAR99; Height: 800µm; Harmonized Tariff Schedule (HTS) Code: 8541.40.20.00; Illumination Color: Blue; Introduction Date: 2001-10-22; Lead Free: Lead Free; Length: 2mm; Lens Style: Clear; Lens Transparency: Clear; Lifecycle Status: Production; Max Operating Temperature: 80°C; Min Operating Temperature: -20°C; Mounting Technology: Surface Mount; Number of Elements: 1; Number of LEDs: 1; Pins: 2; Number of Terminals: 2; Radiation Hardening: No; REACH SVHC: Yes; Schedule B: 8541402000, 8541402000|8541402000|8541402000|8541402000|8541402000; Terminal Pitch: 2.5mm; Test Current: 20mA; Wavelength: 475nm; Width: 1.25mm; ComponentLink1URL: https://datasheet.octopart.com:443/LTST-C171TBKT-Lite-On-datasheet-26684740.pdf?src-supplier=ODG+(Origin+Data+Global); ComponentLink1Description: https://datasheet.octopart.com:443/LTST-C171TBKT-Lite-On-datasheet-26684740.pdf?src-supplier=ODG+(Origin+Data+Global); ComponentLink2URL: https://datasheet.octopart.com:443/LTST-C171TBKT-Lite-On-datasheet-180605166.pdf?src-supplier=IHS; ComponentLink2Description: https://datasheet.octopart.com:443/LTST-C171TBKT-Lite-On-datasheet-180605166.pdf?src-supplier=IHS; ComponentLink3URL: https://datasheet.octopart.com:443/LTST-C171TBKT-Lite-On-datasheet-91253.pdf?src-supplier=Future+Electronics; ComponentLink3Description: https://datasheet.octopart.com:443/LTST-C171TBKT-Lite-On-datasheet-91253.pdf?src-supplier=Future+Electronics; ComponentLink4URL: https://datasheet.octopart.com:443/LTST-C171TBKT-Lite-On-datasheet-166322636.pdf?src-supplier=TME; ComponentLink4Description: https://datasheet.octopart.com:443/LTST-C171TBKT-Lite-On-datasheet-166322636.pdf?src-supplier=TME; ComponentLink5URL: https://datasheet.octopart.com:443/LTST-C171TBKT-Lite-On-datasheet-165573808.pdf?src-supplier=TME; ComponentLink5Description: https://datasheet.octopart.com:443/LTST-C171TBKT-Lite-On-datasheet-165573808.pdf?src-supplier=TME; ComponentLink6URL: https://datasheet.octopart.com:443/LTST-C171TBKT-Lite-On-datasheet-13703740.pdf?src-supplier=_legacy+Avnet; ComponentLink6Description: https://datasheet.octopart.com:443/LTST-C171TBKT-Lite-On-datasheet-13703740.pdf?src-supplier=_legacy+Avnet; ComponentLink7URL: https://datasheet.octopart.com:443/LTST-C171TBKT-Lite-On-datasheet-158537.pdf?src-supplier=Mouser; ComponentLink7Description: https://datasheet.octopart.com:443/LTST-C171TBKT-Lite-On-datasheet-158537.pdf?src-supplier=Mouser; LCSC Part: C98225
H1 H2 = PH1-10-UA: Conn Unshrouded Header HDR 10 POS 2.54mm Solder ST Top Entry Thru-Hole Bag; Manufacturer: Adam Tech; Contact Resistance: 20mΩ; Current Rating: 3A; Insulation Resistance: 5GΩ; Number of Contacts: 10; Voltage Rating: 250V; Supplier: DigiKey; Supplier Part Number: 2057-PH1-10-UA-ND; Manufacturer Part Number: PH1-10-UA; RoHS: Compliant; Category: Headers and Wire Housings; Stock: 3314; Pricing: 1=0,14, 10=0,117, 100=0,0993, 500=0,0886, 1000=0,08436, 5000=0,07529, 10000=0,0717 (USD); Contact Gender: Male; Contact Material: Brass; Export Control Classification Number (ECCN) Code: EAR99; Height: 9.2456mm; Harmonized Tariff Schedule (HTS) Code: 8536.69.40.40; Introduction Date: 2004-11-19; Lifecycle Status: Production; Max Operating Temperature: 105°C; Min Operating Temperature: -40°C; Pins: 10; Number of Rows: 1; Pitch: 2.54mm; REACH SVHC: Yes; Schedule B: 8536694040, 8536694040|8536694040|8536694040|8536694040|8536694040; Terminal Pitch: 2.54mm; Termination: PCB; ComponentLink1URL: https://datasheet.octopart.com:443/PH1-10-UA-Adam-Tech-datasheet-21182886.pdf?src-supplier=IHS; ComponentLink1Description: https://datasheet.octopart.com:443/PH1-10-UA-Adam-Tech-datasheet-21182886.pdf?src-supplier=IHS; ComponentLink2URL: https://datasheet.octopart.com:443/PH1-10-UA-Adam-Tech-datasheet-189096092.pdf?src-supplier=Master+Electronics; ComponentLink2Description: https://datasheet.octopart.com:443/PH1-10-UA-Adam-Tech-datasheet-189096092.pdf?src-supplier=Master+Electronics; ComponentLink3URL: http://sigma.octopart.com:80/reach_statement/Adam-Tech-company-23.pdf?src-supplier=Compliance+Statements; ComponentLink3Description: http://sigma.octopart.com:80/reach_statement/Adam-Tech-company-23.pdf?src-supplier=Compliance+Statements; ComponentLink4URL: http://sigma.octopart.com:80/rohs_statement/Adam-Tech-company-22.pdf?src-supplier=Compliance+Statements; ComponentLink4Description: http://sigma.octopart.com:80/rohs_statement/Adam-Tech-company-22.pdf?src-supplier=Compliance+Statements; LCSC Part: C3330527
IC3 = W25Q32JVSSIQ TR: NOR Flash Serial (SPI, Dual SPI, Quad SPI) 3V/3.3V 32M-bit 4M x 8 6ns 8-Pin SOIC T/R; Manufacturer: Winbond; Frequency: 104MHz; Interface: SPI, Serial; Memory Format: FLASH, NOR; Supplier: DigiKey; Supplier Part Number: 256-W25Q32JVSSIQTRCT-ND; Manufacturer Part Number: W25Q32JVSSIQ TR; RoHS: Compliant; Category: Flash; Pricing: 1=1,02, 10=0,961, 25=0,9348, 50=0,9148, 100=0,8944, 250=0,86748, 500=0,84706, 1000=0,82672, 2000=0,6452, 4000=0,62918, 6000=0,61991, 10000=0,60834, 14000=0,60081 (USD); Case/Package: SOIC; Max Operating Temperature: 85°C; Min Operating Temperature: -40°C; Schedule B: 8542320070, 8542320070|8542320070|8542320070|8542320070|8542320070|8542320070|8542320070|8542320070|8542320070|8542320070|8542320070|8542320070|8542320070|8542320070|8542320070|8542320070|8542320070|8542320070|8542320070|8542320070|8542320070|8542320070|8542320070|85; ComponentLink1URL: https://datasheet.octopart.com:443/W25Q32JVSSIQ-TR-Winbond-datasheet-113071625.pdf?src-supplier=ODG+(Origin+Data+Global); ComponentLink1Description: https://datasheet.octopart.com:443/W25Q32JVSSIQ-TR-Winbond-datasheet-113071625.pdf?src-supplier=ODG+(Origin+Data+Global); LCSC Part: C179173
L3 = LRC0402CJ27NGV001T: General Purpose Inductor, 0.027uH, 5%, 1 Element, Ceramic-Core, SMD, 0402; Manufacturer: Knowles; DC Resistance (DCR): 900mΩ; Number of Circuits: 1; Q Factor: 8; Self Resonant Frequency: 1.9GHz; Shielding: Unshielded; Test Frequency: 100MHz; Supplier: DigiKey; Supplier Part Number: 712-LRC0402CJ27NGV001TCT-ND; Manufacturer Part Number: LRC0402CJ27NGV001T; RoHS: Compliant; Category: Fixed Inductors; Stock: 583004; Pricing: 1=0,1, 10=0,031, 100=0,0257, 1000=0,02116, 5000=0,01845 (USD); Case/Package: 0402; Core Material: Ceramic; Country of Origin: Taiwan; Export Control Classification Number (ECCN) Code: EAR99; Height: 500µm; Harmonized Tariff Schedule (HTS) Code: 8504.50.40.00; Value: 27nH; Introduction Date: 2018-06-27; Length: 1mm; Lifecycle Status: Production; Max Current Rating: 200mA; Max Operating Temperature: 100°C; Min Operating Temperature: -55°C; Number of Terminals: 2; REACH SVHC: Yes; Tolerance: 5%; Width: 500µm; ComponentLink1URL: https://datasheet.octopart.com:443/LRC0402CJ27NGV001T-Johanson-datasheet-187814626.pdf?src-supplier=IHS; ComponentLink1Description: https://datasheet.octopart.com:443/LRC0402CJ27NGV001T-Johanson-datasheet-187814626.pdf?src-supplier=IHS; ComponentLink2URL: https://datasheet.octopart.com:443/LRC0402CJ27NGV001T-Johanson-datasheet-183008488.pdf?src-supplier=RFMW; ComponentLink2Description: https://datasheet.octopart.com:443/LRC0402CJ27NGV001T-Johanson-datasheet-183008488.pdf?src-supplier=RFMW; ComponentLink3URL: https://datasheet.octopart.com:443/LRC0402CJ27NGV001T-Johanson-datasheet-98397494.pdf?src-supplier=RFMW; ComponentLink3Description: https://datasheet.octopart.com:443/LRC0402CJ27NGV001T-Johanson-datasheet-98397494.pdf?src-supplier=RFMW; LCSC Part: C17449954
R13 R15 R17-R21 = RC0402JR-070RL: GENERAL PURPOSE CHIP RESISTOR Metal Glaze/thick Film, 0.0625W, 0ohm, Surface Mount, 0402; Manufacturer: Yageo Group; Max Power Dissipation: 63mW; Power Dissipation: 62.5mW; Temperature Coefficient: 200ppm/°C; Voltage Rating: 50V; Tolerance: 5%; Supplier: DigiKey; Supplier Part Number: 311-0.0JRCT-ND; Manufacturer Part Number: RC0402JR-070RL; RoHS: Compliant; Category: Chip SMD Resistors; Stock: 12915395; Pricing: 1=0,1, 10=0,010, 25=0,0064, 50=0,0054, 100=0,0047, 250=0,00392, 500=0,00346, 1000=0,00304, 5000=0,0023 (USD); Case Code (Imperial): 0402; China RoHS: Non-Compliant; Composition: Thick Film; Contact Plating: Tin; Depth: 500µm; Features: Moisture Resistant; Height: 350µm; Lead Free: Lead Free; Length: 1mm; Lifecycle Status: Production; Max Operating Temperature: 155°C; Military Standard: Not; Min Operating Temperature: -55°C; Mounting Technology: Surface Mount; Pins: 2; Number of Terminals: 2; Number of Terminations: 2; Packaging: Tape & Reel; Power Rating: 63mW; Radiation Hardening: No; REACH SVHC: Yes; Schedule B: 8533290000, 8533290000|8533290000, 8533290000|8533290000|8533290000, 8533290000|8533290000|8533290000|8533290000; Termination: SMD/SMT; Voltage Rating (DC): 50V; Width: 500µm; ComponentLink1URL: https://datasheet.octopart.com:443/RC0402JR-070RL-Yageo-datasheet-182189538.pdf?src-supplier=IHS; ComponentLink1Description: https://datasheet.octopart.com:443/RC0402JR-070RL-Yageo-datasheet-182189538.pdf?src-supplier=IHS; ComponentLink2URL: https://datasheet.octopart.com:443/RC0402JR-070RL-Yageo-datasheet-10408619.pdf?src-supplier=Newark; ComponentLink2Description: https://datasheet.octopart.com:443/RC0402JR-070RL-Yageo-datasheet-10408619.pdf?src-supplier=Newark; ComponentLink3URL: https://datasheet.octopart.com:443/RC0402JR-070RL-Yageo-Group-datasheet-181964826.pdf?src-supplier=Newark; ComponentLink3Description: https://datasheet.octopart.com:443/RC0402JR-070RL-Yageo-Group-datasheet-181964826.pdf?src-supplier=Newark; ComponentLink4URL: https://datasheet.octopart.com:443/RC0402JR-070RL-Yageo-Group-datasheet-190305687.pdf?src-supplier=Future+Electronics; ComponentLink4Description: https://datasheet.octopart.com:443/RC0402JR-070RL-Yageo-Group-datasheet-190305687.pdf?src-supplier=Future+Electronics; ComponentLink5URL: https://datasheet.octopart.com:443/RC0402JR-070RL-Yageo-datasheet-164759695.pdf?src-supplier=Future+Electronics; ComponentLink5Description: https://datasheet.octopart.com:443/RC0402JR-070RL-Yageo-datasheet-164759695.pdf?src-supplier=Future+Electronics; ComponentLink6URL: https://datasheet.octopart.com:443/RC0402JR-070RL-Yageo-datasheet-137700087.pdf?src-supplier=Future+Electronics; ComponentLink6Description: https://datasheet.octopart.com:443/RC0402JR-070RL-Yageo-datasheet-137700087.pdf?src-supplier=Future+Electronics; ComponentLink7URL: https://datasheet.octopart.com:443/RC0402JR-070RL-Yageo-datasheet-12531192.pdf?src-supplier=Seeed+Studio; ComponentLink7Description: https://datasheet.octopart.com:443/RC0402JR-070RL-Yageo-datasheet-12531192.pdf?src-supplier=Seeed+Studio; ComponentLink8URL: https://datasheet.octopart.com:443/RC0402JR-070RL-Yageo-datasheet-8324527.pdf?src-supplier=TME; ComponentLink8Description: https://datasheet.octopart.com:443/RC0402JR-070RL-Yageo-datasheet-8324527.pdf?src-supplier=TME; ComponentLink9URL: https://datasheet.octopart.com:443/RC0402JR-070RL-Yageo-datasheet-62067350.pdf?src-supplier=Farnell; ComponentLink9Description: https://datasheet.octopart.com:443/RC0402JR-070RL-Yageo-datasheet-62067350.pdf?src-supplier=Farnell; ComponentLink10URL: https://datasheet.octopart.com:443/RC0402JR-070RL-Yageo-datasheet-8329306.pdf?src-supplier=element14; ComponentLink10Description: https://datasheet.octopart.com:443/RC0402JR-070RL-Yageo-datasheet-8329306.pdf?src-supplier=element14; ComponentLink11URL: https://datasheet.octopart.com:443/RC0402JR-070RL-Yageo-datasheet-505231.pdf?src-supplier=element14; ComponentLink11Description: https://datasheet.octopart.com:443/RC0402JR-070RL-Yageo-datasheet-505231.pdf?src-supplier=element14; ComponentLink12URL: https://datasheet.octopart.com:443/RC0402JR-070RL-Yageo-datasheet-175423674.pdf?src-supplier=SOS+electronic; ComponentLink12Description: https://datasheet.octopart.com:443/RC0402JR-070RL-Yageo-datasheet-175423674.pdf?src-supplier=SOS+electronic; ComponentLink13URL: https://datasheet.octopart.com/RC0402JR-070RL-Yageo-datasheet-73766026.pdf; ComponentLink13Description: https://datasheet.octopart.com/RC0402JR-070RL-Yageo-datasheet-73766026.pdf; ComponentLink14URL: http://sigma.octopart.com:80/conflict_mineral_statement/Yageo-company-3.pdf?src-supplier=Compliance+Statements; ComponentLink14Description: http://sigma.octopart.com:80/conflict_mineral_statement/Yageo-company-3.pdf?src-supplier=Compliance+Statements; ComponentLink15URL: http://sigma.octopart.com:80/rohs_statement/Yageo-company-2.pdf?src-supplier=Compliance+Statements; ComponentLink15Description: http://sigma.octopart.com:80/rohs_statement/Yageo-company-2.pdf?src-supplier=Compliance+Statements; LCSC Part: C60485; Case/Package: 0402
R14 R16 = RT0402FRE0727RL: 62.5mW Thin Film Resistor ±50ppm/℃ ±1% 27Ω 0402 Chip Resistor - Surface Mount ROHS; Manufacturer: Yageo Group; Max Power Dissipation: 63mW; Temperature Coefficient: 50ppm/°C; Voltage Rating: 50V; Supplier: DigiKey; Supplier Part Number: YAG3343CT-ND; Manufacturer Part Number: RT0402FRE0727RL; RoHS: Compliant; Category: Chip SMD Resistors; Stock: 113870; Pricing: 1=0,1, 10=0,014, 25=0,0132, 50=0,0126, 100=0,0119, 250=0,01108, 500=0,01044, 1000=0,00987, 5000=0,00871 (USD); Case Code (Imperial): 0402; China RoHS: Non-Compliant; Composition: Thin Film; Depth: 500µm; Features: Moisture Resistant; Height: 300µm; Lead Free: Lead Free; Length: 1mm; Lifecycle Status: Production; Max Operating Temperature: 155°C; Military Standard: Not; Min Operating Temperature: -55°C; Mounting Technology: Surface Mount; Number of Terminals: 2; Number of Terminations: 2; Power Rating: 62.5mW; REACH SVHC: Yes; Schedule B: 8533210045, 8533210045|8533210045|8533210045|8533210045|8533210045; Termination: SMD/SMT; Voltage Rating (DC): 50V; Width: 500µm; Working Voltage: 50V; ComponentLink1URL: https://datasheet.octopart.com:443/RT0402FRE0727RL-Yageo-datasheet-176402239.pdf?src-supplier=Future+Electronics; ComponentLink1Description: https://datasheet.octopart.com:443/RT0402FRE0727RL-Yageo-datasheet-176402239.pdf?src-supplier=Future+Electronics; ComponentLink2URL: https://datasheet.octopart.com:443/RT0402FRE0727RL-Yageo-datasheet-169971040.pdf?src-supplier=Future+Electronics; ComponentLink2Description: https://datasheet.octopart.com:443/RT0402FRE0727RL-Yageo-datasheet-169971040.pdf?src-supplier=Future+Electronics; ComponentLink3URL: https://datasheet.octopart.com:443/RT0402FRE0727RL-Yageo-datasheet-164439670.pdf?src-supplier=Future+Electronics; ComponentLink3Description: https://datasheet.octopart.com:443/RT0402FRE0727RL-Yageo-datasheet-164439670.pdf?src-supplier=Future+Electronics; ComponentLink4URL: https://datasheet.octopart.com:443/RT0402FRE0727RL-Yageo-datasheet-96443642.pdf?src-supplier=Upverter; ComponentLink4Description: https://datasheet.octopart.com:443/RT0402FRE0727RL-Yageo-datasheet-96443642.pdf?src-supplier=Upverter; ComponentLink5URL: https://datasheet.octopart.com:443/RT0402FRE0727RL-Yageo-Group-datasheet-141265893.pdf?src-supplier=ODG+(Origin+Data+Global); ComponentLink5Description: https://datasheet.octopart.com:443/RT0402FRE0727RL-Yageo-Group-datasheet-141265893.pdf?src-supplier=ODG+(Origin+Data+Global); ComponentLink6URL: https://datasheet.octopart.com/RT0402FRE0727RL-Yageo-datasheet-86813807.pdf; ComponentLink6Description: https://datasheet.octopart.com/RT0402FRE0727RL-Yageo-datasheet-86813807.pdf; ComponentLink7URL: http://sigma.octopart.com:80/conflict_mineral_statement/Yageo-company-3.pdf?src-supplier=Compliance+Statements; ComponentLink7Description: http://sigma.octopart.com:80/conflict_mineral_statement/Yageo-company-3.pdf?src-supplier=Compliance+Statements; ComponentLink8URL: http://sigma.octopart.com:80/rohs_statement/Yageo-company-2.pdf?src-supplier=Compliance+Statements; ComponentLink8Description: http://sigma.octopart.com:80/rohs_statement/Yageo-company-2.pdf?src-supplier=Compliance+Statements; Tolerance: 1%